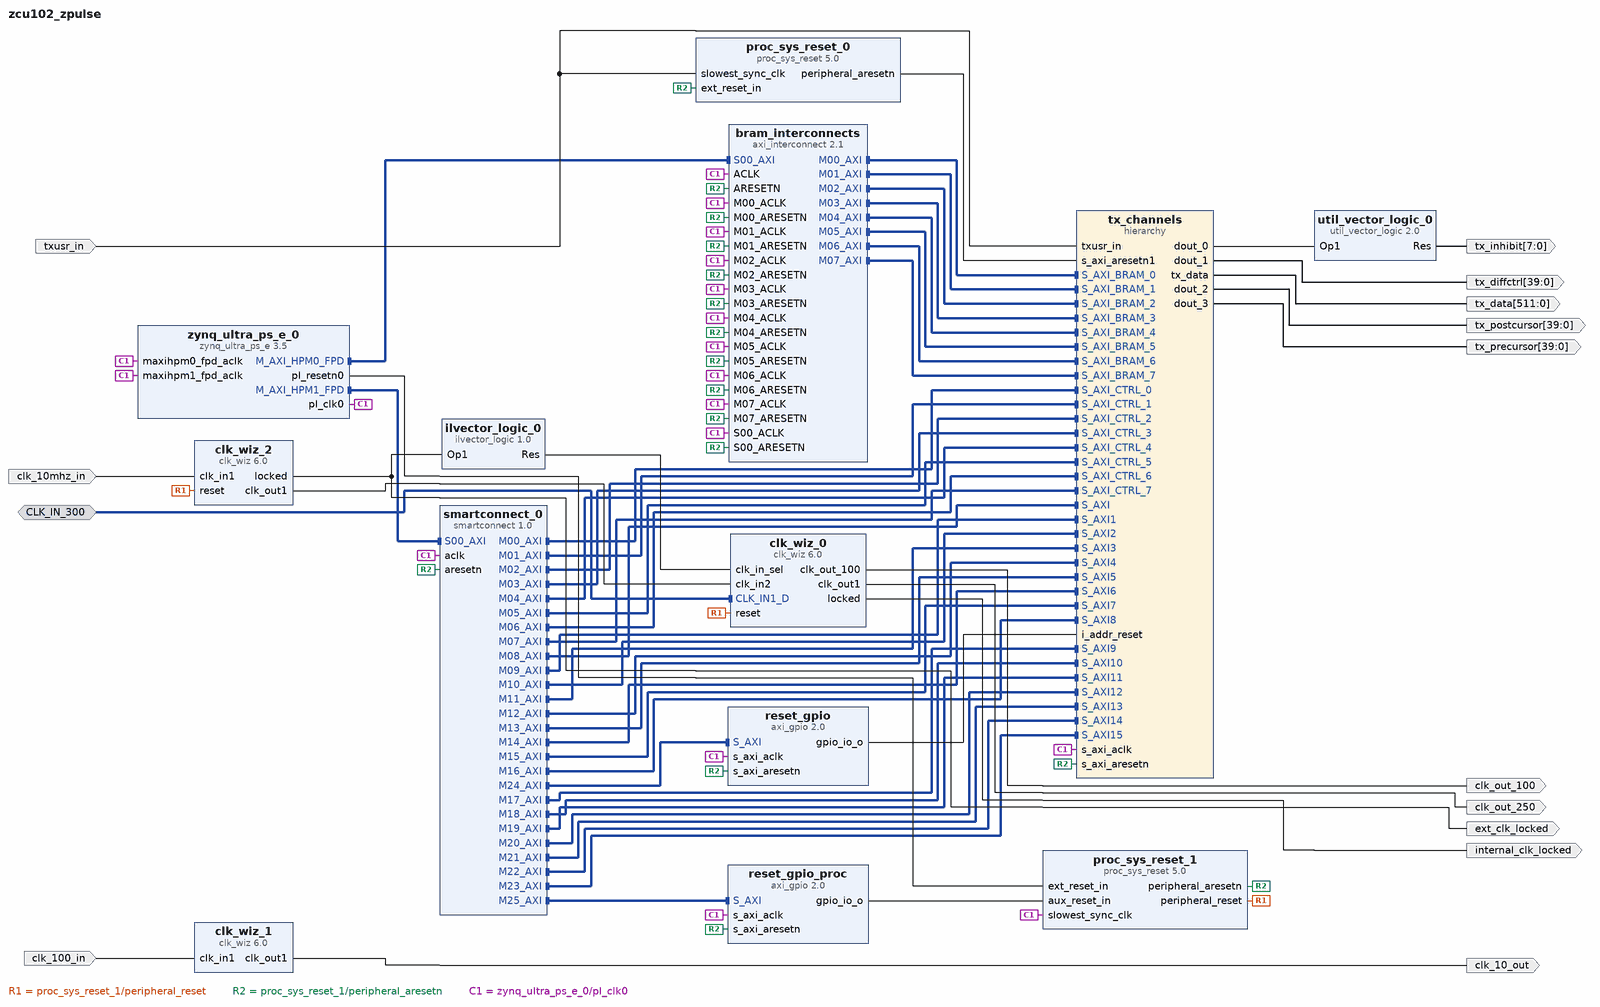
[diagram p0: block diagram of the top level]
# Vivado block design zcu102_zpulse, xczu9eg-ffvb1156-2-e, Vivado 2025.2
create_bd_design zcu102_zpulse

create_bd_intf_port -mode Slave -vlnv xilinx.com:interface:diff_clock_rtl:1.0 CLK_IN_300
create_bd_port -dir O -type clk clk_out_250
create_bd_port -dir I -type clk txusr_in
set_property -dict {CONFIG.FREQ_HZ 250000000} [get_bd_ports txusr_in]
create_bd_port -dir O -type clk clk_10_out
create_bd_port -dir O internal_clk_locked
create_bd_port -dir I -type clk clk_10mhz_in
set_property -dict {CONFIG.FREQ_HZ 10000000} [get_bd_ports clk_10mhz_in]
create_bd_port -dir O ext_clk_locked
create_bd_port -dir O -type clk clk_out_100
create_bd_port -dir O -from 7 -to 0 tx_inhibit
create_bd_port -dir O -from 511 -to 0 tx_data
create_bd_port -dir O -from 39 -to 0 tx_postcursor
create_bd_port -dir O -from 39 -to 0 tx_diffctrl
create_bd_port -dir O -from 39 -to 0 tx_precursor
create_bd_port -dir I -type clk clk_100_in

create_bd_cell -type ip -vlnv xilinx.com:ip:zynq_ultra_ps_e:3.5 zynq_ultra_ps_e_0
set_property -dict [list \
  CONFIG.CAN0_BOARD_INTERFACE custom \
  CONFIG.CAN1_BOARD_INTERFACE custom \
  CONFIG.CSU_BOARD_INTERFACE custom \
  CONFIG.DP_BOARD_INTERFACE custom \
  CONFIG.GEM0_BOARD_INTERFACE custom \
  CONFIG.GEM1_BOARD_INTERFACE custom \
  CONFIG.GEM2_BOARD_INTERFACE custom \
  CONFIG.GEM3_BOARD_INTERFACE custom \
  CONFIG.GPIO_BOARD_INTERFACE custom \
  CONFIG.IIC0_BOARD_INTERFACE custom \
  CONFIG.IIC1_BOARD_INTERFACE custom \
  CONFIG.NAND_BOARD_INTERFACE custom \
  CONFIG.PCIE_BOARD_INTERFACE custom \
  CONFIG.PJTAG_BOARD_INTERFACE custom \
  CONFIG.PMU_BOARD_INTERFACE custom \
  CONFIG.PSU_BANK_0_IO_STANDARD LVCMOS18 \
  CONFIG.PSU_BANK_1_IO_STANDARD LVCMOS18 \
  CONFIG.PSU_BANK_2_IO_STANDARD LVCMOS18 \
  CONFIG.PSU_BANK_3_IO_STANDARD LVCMOS18 \
  CONFIG.PSU_DYNAMIC_DDR_CONFIG_EN 1 \
  CONFIG.PSU_USB3__DUAL_CLOCK_ENABLE 1 \
  CONFIG.PSU__CAN1__PERIPHERAL__ENABLE 1 \
  CONFIG.PSU__CAN1__PERIPHERAL__IO {MIO 24 .. 25} \
  CONFIG.PSU__CRF_APB__ACPU_CTRL__FREQMHZ 1200 \
  CONFIG.PSU__CRF_APB__ACPU_CTRL__SRCSEL APLL \
  CONFIG.PSU__CRF_APB__APLL_CTRL__SRCSEL PSS_REF_CLK \
  CONFIG.PSU__CRF_APB__DBG_FPD_CTRL__FREQMHZ 250 \
  CONFIG.PSU__CRF_APB__DBG_FPD_CTRL__SRCSEL IOPLL \
  CONFIG.PSU__CRF_APB__DBG_TRACE_CTRL__FREQMHZ 125 \
  CONFIG.PSU__CRF_APB__DBG_TRACE_CTRL__SRCSEL IOPLL \
  CONFIG.PSU__CRF_APB__DBG_TSTMP_CTRL__FREQMHZ 250 \
  CONFIG.PSU__CRF_APB__DBG_TSTMP_CTRL__SRCSEL IOPLL \
  CONFIG.PSU__CRF_APB__DDR_CTRL__FREQMHZ 1067 \
  CONFIG.PSU__CRF_APB__DDR_CTRL__SRCSEL DPLL \
  CONFIG.PSU__CRF_APB__DPDMA_REF_CTRL__FREQMHZ 600 \
  CONFIG.PSU__CRF_APB__DPDMA_REF_CTRL__SRCSEL APLL \
  CONFIG.PSU__CRF_APB__DPLL_CTRL__SRCSEL PSS_REF_CLK \
  CONFIG.PSU__CRF_APB__DP_AUDIO_REF_CTRL__SRCSEL RPLL \
  CONFIG.PSU__CRF_APB__DP_STC_REF_CTRL__SRCSEL RPLL \
  CONFIG.PSU__CRF_APB__DP_VIDEO_REF_CTRL__SRCSEL VPLL \
  CONFIG.PSU__CRF_APB__GDMA_REF_CTRL__FREQMHZ 600 \
  CONFIG.PSU__CRF_APB__GDMA_REF_CTRL__SRCSEL APLL \
  CONFIG.PSU__CRF_APB__GPU_REF_CTRL__FREQMHZ 500 \
  CONFIG.PSU__CRF_APB__GPU_REF_CTRL__SRCSEL IOPLL \
  CONFIG.PSU__CRF_APB__TOPSW_LSBUS_CTRL__FREQMHZ 100 \
  CONFIG.PSU__CRF_APB__TOPSW_LSBUS_CTRL__SRCSEL IOPLL \
  CONFIG.PSU__CRF_APB__TOPSW_MAIN_CTRL__FREQMHZ 533.33 \
  CONFIG.PSU__CRF_APB__TOPSW_MAIN_CTRL__SRCSEL DPLL \
  CONFIG.PSU__CRF_APB__VPLL_CTRL__SRCSEL PSS_REF_CLK \
  CONFIG.PSU__CRL_APB__ADMA_REF_CTRL__FREQMHZ 500 \
  CONFIG.PSU__CRL_APB__ADMA_REF_CTRL__SRCSEL IOPLL \
  CONFIG.PSU__CRL_APB__CAN1_REF_CTRL__FREQMHZ 100 \
  CONFIG.PSU__CRL_APB__CAN1_REF_CTRL__SRCSEL IOPLL \
  CONFIG.PSU__CRL_APB__CPU_R5_CTRL__FREQMHZ 500 \
  CONFIG.PSU__CRL_APB__CPU_R5_CTRL__SRCSEL IOPLL \
  CONFIG.PSU__CRL_APB__DBG_LPD_CTRL__FREQMHZ 250 \
  CONFIG.PSU__CRL_APB__DBG_LPD_CTRL__SRCSEL IOPLL \
  CONFIG.PSU__CRL_APB__GEM3_REF_CTRL__FREQMHZ 125 \
  CONFIG.PSU__CRL_APB__GEM3_REF_CTRL__SRCSEL IOPLL \
  CONFIG.PSU__CRL_APB__I2C0_REF_CTRL__FREQMHZ 100 \
  CONFIG.PSU__CRL_APB__I2C0_REF_CTRL__SRCSEL IOPLL \
  CONFIG.PSU__CRL_APB__I2C1_REF_CTRL__FREQMHZ 100 \
  CONFIG.PSU__CRL_APB__I2C1_REF_CTRL__SRCSEL IOPLL \
  CONFIG.PSU__CRL_APB__IOPLL_CTRL__SRCSEL PSS_REF_CLK \
  CONFIG.PSU__CRL_APB__IOU_SWITCH_CTRL__FREQMHZ 250 \
  CONFIG.PSU__CRL_APB__IOU_SWITCH_CTRL__SRCSEL IOPLL \
  CONFIG.PSU__CRL_APB__LPD_LSBUS_CTRL__FREQMHZ 100 \
  CONFIG.PSU__CRL_APB__LPD_LSBUS_CTRL__SRCSEL IOPLL \
  CONFIG.PSU__CRL_APB__LPD_SWITCH_CTRL__FREQMHZ 500 \
  CONFIG.PSU__CRL_APB__LPD_SWITCH_CTRL__SRCSEL IOPLL \
  CONFIG.PSU__CRL_APB__PCAP_CTRL__FREQMHZ 200 \
  CONFIG.PSU__CRL_APB__PCAP_CTRL__SRCSEL IOPLL \
  CONFIG.PSU__CRL_APB__PL0_REF_CTRL__FREQMHZ 100 \
  CONFIG.PSU__CRL_APB__PL0_REF_CTRL__SRCSEL IOPLL \
  CONFIG.PSU__CRL_APB__QSPI_REF_CTRL__FREQMHZ 125 \
  CONFIG.PSU__CRL_APB__QSPI_REF_CTRL__SRCSEL IOPLL \
  CONFIG.PSU__CRL_APB__RPLL_CTRL__SRCSEL PSS_REF_CLK \
  CONFIG.PSU__CRL_APB__SDIO1_REF_CTRL__FREQMHZ 200 \
  CONFIG.PSU__CRL_APB__SDIO1_REF_CTRL__SRCSEL IOPLL \
  CONFIG.PSU__CRL_APB__TIMESTAMP_REF_CTRL__FREQMHZ 100 \
  CONFIG.PSU__CRL_APB__TIMESTAMP_REF_CTRL__SRCSEL IOPLL \
  CONFIG.PSU__CRL_APB__UART0_REF_CTRL__FREQMHZ 100 \
  CONFIG.PSU__CRL_APB__UART0_REF_CTRL__SRCSEL IOPLL \
  CONFIG.PSU__CRL_APB__UART1_REF_CTRL__FREQMHZ 100 \
  CONFIG.PSU__CRL_APB__UART1_REF_CTRL__SRCSEL IOPLL \
  CONFIG.PSU__CRL_APB__USB0_BUS_REF_CTRL__FREQMHZ 250 \
  CONFIG.PSU__CRL_APB__USB0_BUS_REF_CTRL__SRCSEL IOPLL \
  CONFIG.PSU__CRL_APB__USB3_DUAL_REF_CTRL__FREQMHZ 20 \
  CONFIG.PSU__CRL_APB__USB3_DUAL_REF_CTRL__SRCSEL IOPLL \
  CONFIG.PSU__CRL_APB__USB3__ENABLE 1 \
  CONFIG.PSU__CSUPMU__PERIPHERAL__VALID 1 \
  CONFIG.PSU__DDRC__BUS_WIDTH {64 Bit} \
  CONFIG.PSU__DDRC__COMPONENTS UDIMM \
  CONFIG.PSU__DDRC__DEVICE_CAPACITY {4096 MBits} \
  CONFIG.PSU__DDRC__DRAM_WIDTH {8 Bits} \
  CONFIG.PSU__DDRC__ECC Disabled \
  CONFIG.PSU__DDRC__MEMORY_TYPE {DDR 4} \
  CONFIG.PSU__DDRC__SPEED_BIN DDR4_2133P \
  CONFIG.PSU__DDR_HIGH_ADDRESS_GUI_ENABLE 1 \
  CONFIG.PSU__DDR__INTERFACE__FREQMHZ 533.500 \
  CONFIG.PSU__DEVICE_TYPE EG \
  CONFIG.PSU__DISPLAYPORT__LANE0__ENABLE 1 \
  CONFIG.PSU__DISPLAYPORT__LANE0__IO {GT Lane1} \
  CONFIG.PSU__DISPLAYPORT__LANE1__ENABLE 0 \
  CONFIG.PSU__DISPLAYPORT__PERIPHERAL__ENABLE 1 \
  CONFIG.PSU__DLL__ISUSED 1 \
  CONFIG.PSU__DPAUX__PERIPHERAL__ENABLE 1 \
  CONFIG.PSU__DPAUX__PERIPHERAL__IO {MIO 27 .. 30} \
  CONFIG.PSU__DP__LANE_SEL {Single Lower} \
  CONFIG.PSU__DP__REF_CLK_FREQ 27 \
  CONFIG.PSU__DP__REF_CLK_SEL {Ref Clk3} \
  CONFIG.PSU__ENET3__FIFO__ENABLE 0 \
  CONFIG.PSU__ENET3__GRP_MDIO__ENABLE 1 \
  CONFIG.PSU__ENET3__GRP_MDIO__IO {MIO 76 .. 77} \
  CONFIG.PSU__ENET3__PERIPHERAL__ENABLE 1 \
  CONFIG.PSU__ENET3__PERIPHERAL__IO {MIO 64 .. 75} \
  CONFIG.PSU__ENET3__PTP__ENABLE 0 \
  CONFIG.PSU__ENET3__TSU__ENABLE 0 \
  CONFIG.PSU__FPGA_PL0_ENABLE 1 \
  CONFIG.PSU__GEM3_COHERENCY 0 \
  CONFIG.PSU__GEM3_ROUTE_THROUGH_FPD 0 \
  CONFIG.PSU__GEM__TSU__ENABLE 0 \
  CONFIG.PSU__GPIO0_MIO__IO {MIO 0 .. 25} \
  CONFIG.PSU__GPIO0_MIO__PERIPHERAL__ENABLE 1 \
  CONFIG.PSU__GPIO1_MIO__IO {MIO 26 .. 51} \
  CONFIG.PSU__GPIO1_MIO__PERIPHERAL__ENABLE 1 \
  CONFIG.PSU__GT__LINK_SPEED HBR \
  CONFIG.PSU__GT__PRE_EMPH_LVL_4 0 \
  CONFIG.PSU__GT__VLT_SWNG_LVL_4 0 \
  CONFIG.PSU__I2C0__PERIPHERAL__ENABLE 1 \
  CONFIG.PSU__I2C0__PERIPHERAL__IO {MIO 14 .. 15} \
  CONFIG.PSU__I2C1__PERIPHERAL__ENABLE 1 \
  CONFIG.PSU__I2C1__PERIPHERAL__IO {MIO 16 .. 17} \
  CONFIG.PSU__IOU_SLCR__IOU_TTC_APB_CLK__TTC0_SEL APB \
  CONFIG.PSU__IOU_SLCR__IOU_TTC_APB_CLK__TTC1_SEL APB \
  CONFIG.PSU__IOU_SLCR__IOU_TTC_APB_CLK__TTC2_SEL APB \
  CONFIG.PSU__IOU_SLCR__IOU_TTC_APB_CLK__TTC3_SEL APB \
  CONFIG.PSU__IRQ_P2F_USB2_OTG__INT0 0 \
  CONFIG.PSU__IRQ_P2F_USB2_OTG__INT1 0 \
  CONFIG.PSU__MAXIGP0__DATA_WIDTH 128 \
  CONFIG.PSU__OVERRIDE_HPX_QOS 0 \
  CONFIG.PSU__OVERRIDE__BASIC_CLOCK 0 \
  CONFIG.PSU__PCIE__BAR0_VAL 0x0 \
  CONFIG.PSU__PCIE__BAR1_VAL 0x0 \
  CONFIG.PSU__PCIE__BAR2_VAL 0x0 \
  CONFIG.PSU__PCIE__BAR3_VAL 0x0 \
  CONFIG.PSU__PCIE__BAR4_VAL 0x0 \
  CONFIG.PSU__PCIE__BAR5_VAL 0x0 \
  CONFIG.PSU__PCIE__CLASS_CODE_BASE 0x06 \
  CONFIG.PSU__PCIE__CLASS_CODE_INTERFACE 0x0 \
  CONFIG.PSU__PCIE__CLASS_CODE_SUB 0x4 \
  CONFIG.PSU__PCIE__CLASS_CODE_VALUE 0x60400 \
  CONFIG.PSU__PCIE__CRS_SW_VISIBILITY 1 \
  CONFIG.PSU__PCIE__DEVICE_ID 0xD021 \
  CONFIG.PSU__PCIE__DEVICE_PORT_TYPE {Root Port} \
  CONFIG.PSU__PCIE__EROM_VAL 0x0 \
  CONFIG.PSU__PCIE__LANE0__ENABLE 1 \
  CONFIG.PSU__PCIE__LANE0__IO {GT Lane0} \
  CONFIG.PSU__PCIE__LINK_SPEED {5.0 Gb/s} \
  CONFIG.PSU__PCIE__MAXIMUM_LINK_WIDTH x1 \
  CONFIG.PSU__PCIE__MAX_PAYLOAD_SIZE {256 bytes} \
  CONFIG.PSU__PCIE__PERIPHERAL__ENABLE 1 \
  CONFIG.PSU__PCIE__PERIPHERAL__ENDPOINT_ENABLE 0 \
  CONFIG.PSU__PCIE__PERIPHERAL__ROOTPORT_ENABLE 1 \
  CONFIG.PSU__PCIE__PERIPHERAL__ROOTPORT_IO {MIO 31} \
  CONFIG.PSU__PCIE__REF_CLK_FREQ 100 \
  CONFIG.PSU__PCIE__REF_CLK_SEL {Ref Clk0} \
  CONFIG.PSU__PCIE__REVISION_ID 0x0 \
  CONFIG.PSU__PCIE__SUBSYSTEM_ID 0x7 \
  CONFIG.PSU__PCIE__SUBSYSTEM_VENDOR_ID 0x10EE \
  CONFIG.PSU__PCIE__VENDOR_ID 0x10EE \
  CONFIG.PSU__PMU_COHERENCY 0 \
  CONFIG.PSU__PMU__AIBACK__ENABLE 0 \
  CONFIG.PSU__PMU__EMIO_GPI__ENABLE 0 \
  CONFIG.PSU__PMU__EMIO_GPO__ENABLE 0 \
  CONFIG.PSU__PMU__GPI0__ENABLE 0 \
  CONFIG.PSU__PMU__GPI1__ENABLE 0 \
  CONFIG.PSU__PMU__GPI2__ENABLE 0 \
  CONFIG.PSU__PMU__GPI3__ENABLE 0 \
  CONFIG.PSU__PMU__GPI4__ENABLE 0 \
  CONFIG.PSU__PMU__GPI5__ENABLE 0 \
  CONFIG.PSU__PMU__GPO0__ENABLE 1 \
  CONFIG.PSU__PMU__GPO0__IO {MIO 32} \
  CONFIG.PSU__PMU__GPO1__ENABLE 1 \
  CONFIG.PSU__PMU__GPO1__IO {MIO 33} \
  CONFIG.PSU__PMU__GPO2__ENABLE 1 \
  CONFIG.PSU__PMU__GPO2__IO {MIO 34} \
  CONFIG.PSU__PMU__GPO2__POLARITY high \
  CONFIG.PSU__PMU__GPO3__ENABLE 1 \
  CONFIG.PSU__PMU__GPO3__IO {MIO 35} \
  CONFIG.PSU__PMU__GPO3__POLARITY low \
  CONFIG.PSU__PMU__GPO4__ENABLE 1 \
  CONFIG.PSU__PMU__GPO4__IO {MIO 36} \
  CONFIG.PSU__PMU__GPO4__POLARITY low \
  CONFIG.PSU__PMU__GPO5__ENABLE 1 \
  CONFIG.PSU__PMU__GPO5__IO {MIO 37} \
  CONFIG.PSU__PMU__GPO5__POLARITY low \
  CONFIG.PSU__PMU__PERIPHERAL__ENABLE 1 \
  CONFIG.PSU__PMU__PLERROR__ENABLE 0 \
  CONFIG.PSU__PRESET_APPLIED 1 \
  CONFIG.PSU__PSS_REF_CLK__FREQMHZ 33.330 \
  CONFIG.PSU__QSPI_COHERENCY 0 \
  CONFIG.PSU__QSPI_ROUTE_THROUGH_FPD 0 \
  CONFIG.PSU__QSPI__GRP_FBCLK__ENABLE 1 \
  CONFIG.PSU__QSPI__GRP_FBCLK__IO {MIO 6} \
  CONFIG.PSU__QSPI__PERIPHERAL__DATA_MODE x4 \
  CONFIG.PSU__QSPI__PERIPHERAL__ENABLE 1 \
  CONFIG.PSU__QSPI__PERIPHERAL__IO {MIO 0 .. 12} \
  CONFIG.PSU__QSPI__PERIPHERAL__MODE {Dual Parallel} \
  CONFIG.PSU__SATA__LANE1__IO {GT Lane3} \
  CONFIG.PSU__SATA__PERIPHERAL__ENABLE 1 \
  CONFIG.PSU__SATA__REF_CLK_FREQ 125 \
  CONFIG.PSU__SATA__REF_CLK_SEL {Ref Clk1} \
  CONFIG.PSU__SD0__CLK_100_SDR_OTAP_DLY 0x3 \
  CONFIG.PSU__SD0__CLK_200_SDR_OTAP_DLY 0x3 \
  CONFIG.PSU__SD0__CLK_50_DDR_ITAP_DLY 0x3D \
  CONFIG.PSU__SD0__CLK_50_DDR_OTAP_DLY 0x4 \
  CONFIG.PSU__SD0__CLK_50_SDR_ITAP_DLY 0x15 \
  CONFIG.PSU__SD0__CLK_50_SDR_OTAP_DLY 0x5 \
  CONFIG.PSU__SD1_COHERENCY 0 \
  CONFIG.PSU__SD1_ROUTE_THROUGH_FPD 0 \
  CONFIG.PSU__SD1__CLK_100_SDR_OTAP_DLY 0x3 \
  CONFIG.PSU__SD1__CLK_200_SDR_OTAP_DLY 0x3 \
  CONFIG.PSU__SD1__CLK_50_DDR_ITAP_DLY 0x3D \
  CONFIG.PSU__SD1__CLK_50_DDR_OTAP_DLY 0x4 \
  CONFIG.PSU__SD1__CLK_50_SDR_ITAP_DLY 0x15 \
  CONFIG.PSU__SD1__CLK_50_SDR_OTAP_DLY 0x5 \
  CONFIG.PSU__SD1__DATA_TRANSFER_MODE 8Bit \
  CONFIG.PSU__SD1__GRP_CD__ENABLE 1 \
  CONFIG.PSU__SD1__GRP_CD__IO {MIO 45} \
  CONFIG.PSU__SD1__GRP_POW__ENABLE 0 \
  CONFIG.PSU__SD1__GRP_WP__ENABLE 1 \
  CONFIG.PSU__SD1__GRP_WP__IO {MIO 44} \
  CONFIG.PSU__SD1__PERIPHERAL__ENABLE 1 \
  CONFIG.PSU__SD1__PERIPHERAL__IO {MIO 39 .. 51} \
  CONFIG.PSU__SD1__SLOT_TYPE {SD 3.0} \
  CONFIG.PSU__SWDT0__CLOCK__ENABLE 0 \
  CONFIG.PSU__SWDT0__PERIPHERAL__ENABLE 1 \
  CONFIG.PSU__SWDT0__RESET__ENABLE 0 \
  CONFIG.PSU__SWDT1__CLOCK__ENABLE 0 \
  CONFIG.PSU__SWDT1__PERIPHERAL__ENABLE 1 \
  CONFIG.PSU__SWDT1__RESET__ENABLE 0 \
  CONFIG.PSU__TSU__BUFG_PORT_PAIR 0 \
  CONFIG.PSU__TTC0__CLOCK__ENABLE 0 \
  CONFIG.PSU__TTC0__PERIPHERAL__ENABLE 1 \
  CONFIG.PSU__TTC0__WAVEOUT__ENABLE 0 \
  CONFIG.PSU__TTC1__CLOCK__ENABLE 0 \
  CONFIG.PSU__TTC1__PERIPHERAL__ENABLE 1 \
  CONFIG.PSU__TTC1__WAVEOUT__ENABLE 0 \
  CONFIG.PSU__TTC2__CLOCK__ENABLE 0 \
  CONFIG.PSU__TTC2__PERIPHERAL__ENABLE 1 \
  CONFIG.PSU__TTC2__WAVEOUT__ENABLE 0 \
  CONFIG.PSU__TTC3__CLOCK__ENABLE 0 \
  CONFIG.PSU__TTC3__PERIPHERAL__ENABLE 1 \
  CONFIG.PSU__TTC3__WAVEOUT__ENABLE 0 \
  CONFIG.PSU__UART0__BAUD_RATE 115200 \
  CONFIG.PSU__UART0__MODEM__ENABLE 0 \
  CONFIG.PSU__UART0__PERIPHERAL__ENABLE 1 \
  CONFIG.PSU__UART0__PERIPHERAL__IO {MIO 18 .. 19} \
  CONFIG.PSU__UART1__BAUD_RATE 115200 \
  CONFIG.PSU__UART1__MODEM__ENABLE 0 \
  CONFIG.PSU__UART1__PERIPHERAL__ENABLE 1 \
  CONFIG.PSU__UART1__PERIPHERAL__IO {MIO 20 .. 21} \
  CONFIG.PSU__USB0_COHERENCY 0 \
  CONFIG.PSU__USB0__PERIPHERAL__ENABLE 1 \
  CONFIG.PSU__USB0__PERIPHERAL__IO {MIO 52 .. 63} \
  CONFIG.PSU__USB0__REF_CLK_FREQ 26 \
  CONFIG.PSU__USB0__REF_CLK_SEL {Ref Clk2} \
  CONFIG.PSU__USB2_0__EMIO__ENABLE 0 \
  CONFIG.PSU__USB3_0__EMIO__ENABLE 0 \
  CONFIG.PSU__USB3_0__PERIPHERAL__ENABLE 1 \
  CONFIG.PSU__USB3_0__PERIPHERAL__IO {GT Lane2} \
  CONFIG.PSU__USB__RESET__MODE {Boot Pin} \
  CONFIG.PSU__USB__RESET__POLARITY {Active Low} \
  CONFIG.PSU__USE__IRQ0 1 \
  CONFIG.PSU__USE__M_AXI_GP0 1 \
  CONFIG.PSU__USE__M_AXI_GP1 1 \
  CONFIG.PSU__USE__M_AXI_GP2 0 \
  CONFIG.QSPI_BOARD_INTERFACE custom \
  CONFIG.SATA_BOARD_INTERFACE custom \
  CONFIG.SD0_BOARD_INTERFACE custom \
  CONFIG.SD1_BOARD_INTERFACE custom \
  CONFIG.SPI0_BOARD_INTERFACE custom \
  CONFIG.SPI1_BOARD_INTERFACE custom \
  CONFIG.SUBPRESET1 Custom \
  CONFIG.SUBPRESET2 Custom \
  CONFIG.SWDT0_BOARD_INTERFACE custom \
  CONFIG.SWDT1_BOARD_INTERFACE custom \
  CONFIG.TRACE_BOARD_INTERFACE custom \
  CONFIG.TTC0_BOARD_INTERFACE custom \
  CONFIG.TTC1_BOARD_INTERFACE custom \
  CONFIG.TTC2_BOARD_INTERFACE custom \
  CONFIG.TTC3_BOARD_INTERFACE custom \
  CONFIG.UART0_BOARD_INTERFACE custom \
  CONFIG.UART1_BOARD_INTERFACE custom \
  CONFIG.USB0_BOARD_INTERFACE custom \
  CONFIG.USB1_BOARD_INTERFACE custom \
  CONFIG.preset None \
] [get_bd_cells zynq_ultra_ps_e_0]
# 727 more settings of zynq_ultra_ps_e_0 are not shown: defaults, MIO pin electricals, DDR timing, and values the tool derives
create_bd_cell -type ip -vlnv xilinx.com:ip:clk_wiz:6.0 clk_wiz_0
set_property -dict [list \
  CONFIG.CLKIN1_JITTER_PS 33.330000000000005 \
  CONFIG.CLKIN2_JITTER_PS 33.330000000000005 \
  CONFIG.CLKOUT1_JITTER 109.006 \
  CONFIG.CLKOUT1_PHASE_ERROR 98.575 \
  CONFIG.CLKOUT1_REQUESTED_OUT_FREQ 250 \
  CONFIG.CLKOUT2_DRIVES Buffer \
  CONFIG.CLKOUT2_JITTER 129.666 \
  CONFIG.CLKOUT2_PHASE_ERROR 98.575 \
  CONFIG.CLKOUT2_USED true \
  CONFIG.CLK_IN1_BOARD_INTERFACE user_si570_sysclk \
  CONFIG.CLK_OUT2_PORT clk_out_100 \
  CONFIG.MMCM_CLKFBOUT_MULT_F 10.000 \
  CONFIG.MMCM_CLKIN1_PERIOD 3.333 \
  CONFIG.MMCM_CLKIN2_PERIOD 3.333 \
  CONFIG.MMCM_CLKOUT0_DIVIDE_F 4.000 \
  CONFIG.MMCM_CLKOUT1_DIVIDE 10 \
  CONFIG.MMCM_DIVCLK_DIVIDE 3 \
  CONFIG.NUM_OUT_CLKS 2 \
  CONFIG.OPTIMIZE_CLOCKING_STRUCTURE_EN true \
  CONFIG.PRIM_SOURCE Differential_clock_capable_pin \
  CONFIG.SECONDARY_IN_FREQ 300.000 \
  CONFIG.SECONDARY_SOURCE Single_ended_clock_capable_pin \
  CONFIG.USE_INCLK_SWITCHOVER true \
  CONFIG.USE_LOCKED true \
  CONFIG.USE_RESET true \
] [get_bd_cells clk_wiz_0]
create_bd_cell -type ip -vlnv xilinx.com:ip:proc_sys_reset:5.0 proc_sys_reset_0
create_bd_cell -type ip -vlnv xilinx.com:ip:proc_sys_reset:5.0 proc_sys_reset_1
set_property -dict {CONFIG.C_AUX_RESET_HIGH 1} [get_bd_cells proc_sys_reset_1]
create_bd_cell -type ip -vlnv xilinx.com:ip:clk_wiz:6.0 clk_wiz_1
set_property -dict [list \
  CONFIG.CLKIN1_JITTER_PS 100.0 \
  CONFIG.CLKOUT1_JITTER 460.700 \
  CONFIG.CLKOUT1_PHASE_ERROR 523.418 \
  CONFIG.CLKOUT1_REQUESTED_OUT_FREQ 10 \
  CONFIG.MMCM_CLKFBOUT_MULT_F 92.375 \
  CONFIG.MMCM_CLKIN1_PERIOD 10.000 \
  CONFIG.MMCM_CLKIN2_PERIOD 10.000 \
  CONFIG.MMCM_CLKOUT0_DIVIDE_F 92.375 \
  CONFIG.MMCM_DIVCLK_DIVIDE 10 \
  CONFIG.OPTIMIZE_CLOCKING_STRUCTURE_EN true \
  CONFIG.PRIM_IN_FREQ 100 \
  CONFIG.USE_LOCKED false \
  CONFIG.USE_RESET false \
] [get_bd_cells clk_wiz_1]
create_bd_cell -type ip -vlnv xilinx.com:ip:smartconnect:1.0 smartconnect_0
set_property -dict {CONFIG.NUM_MI 26 CONFIG.NUM_SI 1} [get_bd_cells smartconnect_0]
create_bd_cell -type ip -vlnv xilinx.com:ip:axi_gpio:2.0 reset_gpio_proc
set_property -dict {CONFIG.C_ALL_OUTPUTS 1 CONFIG.C_GPIO_WIDTH 1} [get_bd_cells reset_gpio_proc]
create_bd_cell -type ip -vlnv xilinx.com:ip:clk_wiz:6.0 clk_wiz_2
set_property -dict [list \
  CONFIG.CLKIN1_JITTER_PS 100.0 \
  CONFIG.CLKIN1_UI_JITTER 0.001 \
  CONFIG.CLKOUT1_DRIVES Buffer \
  CONFIG.CLKOUT1_JITTER 175.558 \
  CONFIG.CLKOUT1_PHASE_ERROR 601.651 \
  CONFIG.CLKOUT1_REQUESTED_OUT_FREQ 300.000 \
  CONFIG.FEEDBACK_SOURCE FDBK_ONCHIP \
  CONFIG.JITTER_SEL Max_I_Jitter \
  CONFIG.MMCM_BANDWIDTH LOW \
  CONFIG.MMCM_CLKFBOUT_MULT_F 120.000 \
  CONFIG.MMCM_CLKIN1_PERIOD 100.000 \
  CONFIG.MMCM_CLKIN2_PERIOD 10.0 \
  CONFIG.MMCM_CLKOUT0_DIVIDE_F 4.000 \
  CONFIG.MMCM_REF_JITTER1 0.001 \
  CONFIG.OPTIMIZE_CLOCKING_STRUCTURE_EN true \
  CONFIG.PRIM_IN_FREQ 10.00 \
] [get_bd_cells clk_wiz_2]
create_bd_cell -type inline_hdl -vlnv xilinx.com:inline_hdl:ilvector_logic:1.0 ilvector_logic_0
set_property -dict {CONFIG.C_OPERATION not CONFIG.C_SIZE 1} [get_bd_cells ilvector_logic_0]
create_bd_cell -type ip -vlnv xilinx.com:ip:util_vector_logic:2.0 util_vector_logic_0
set_property -dict {CONFIG.C_OPERATION not} [get_bd_cells util_vector_logic_0]
create_bd_cell -type ip -vlnv xilinx.com:ip:axi_gpio:2.0 reset_gpio
set_property -dict {CONFIG.C_ALL_OUTPUTS 1 CONFIG.C_GPIO_WIDTH 1} [get_bd_cells reset_gpio]
create_bd_cell -type ip -vlnv xilinx.com:ip:axi_interconnect:2.1 bram_interconnects
set_property -dict {CONFIG.NUM_MI 8} [get_bd_cells bram_interconnects]
create_bd_cell -type hier tx_channels

# ---- hierarchy /tx_channels ----
current_bd_instance /tx_channels
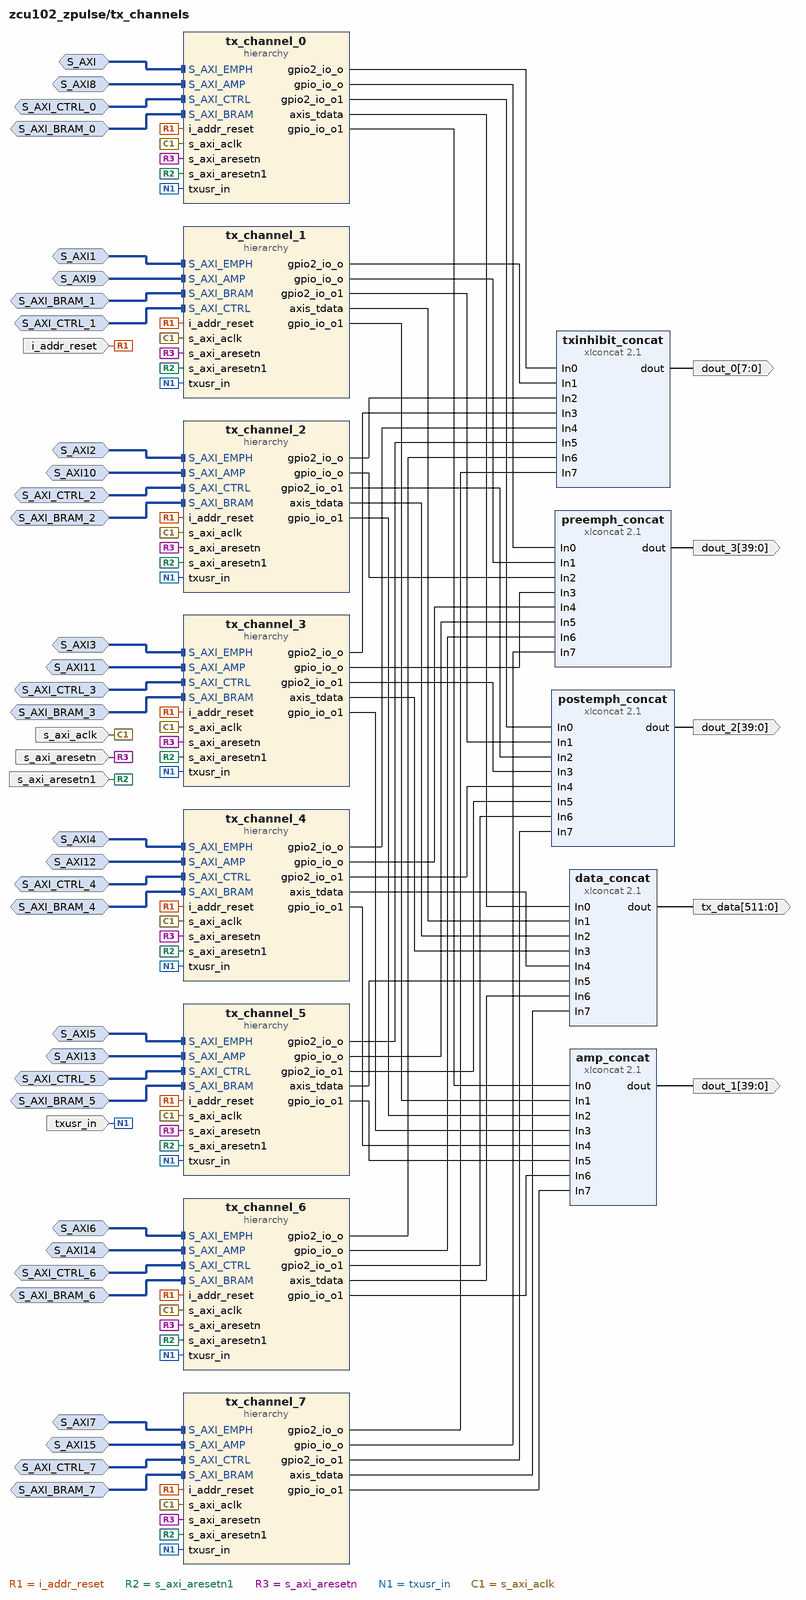
[diagram p1: block diagram inside /tx_channels]
create_bd_intf_pin -mode Slave -vlnv xilinx.com:interface:aximm_rtl:1.0 S_AXI_CTRL_1
create_bd_intf_pin -mode Slave -vlnv xilinx.com:interface:aximm_rtl:1.0 S_AXI_BRAM_1
create_bd_intf_pin -mode Slave -vlnv xilinx.com:interface:aximm_rtl:1.0 S_AXI_CTRL_2
create_bd_intf_pin -mode Slave -vlnv xilinx.com:interface:aximm_rtl:1.0 S_AXI_BRAM_2
create_bd_intf_pin -mode Slave -vlnv xilinx.com:interface:aximm_rtl:1.0 S_AXI_CTRL_3
create_bd_intf_pin -mode Slave -vlnv xilinx.com:interface:aximm_rtl:1.0 S_AXI_BRAM_3
create_bd_intf_pin -mode Slave -vlnv xilinx.com:interface:aximm_rtl:1.0 S_AXI_CTRL_4
create_bd_intf_pin -mode Slave -vlnv xilinx.com:interface:aximm_rtl:1.0 S_AXI_BRAM_4
create_bd_intf_pin -mode Slave -vlnv xilinx.com:interface:aximm_rtl:1.0 S_AXI_CTRL_5
create_bd_intf_pin -mode Slave -vlnv xilinx.com:interface:aximm_rtl:1.0 S_AXI_BRAM_5
create_bd_intf_pin -mode Slave -vlnv xilinx.com:interface:aximm_rtl:1.0 S_AXI_CTRL_6
create_bd_intf_pin -mode Slave -vlnv xilinx.com:interface:aximm_rtl:1.0 S_AXI_BRAM_6
create_bd_intf_pin -mode Slave -vlnv xilinx.com:interface:aximm_rtl:1.0 S_AXI_CTRL_7
create_bd_intf_pin -mode Slave -vlnv xilinx.com:interface:aximm_rtl:1.0 S_AXI_BRAM_7
create_bd_intf_pin -mode Slave -vlnv xilinx.com:interface:aximm_rtl:1.0 S_AXI_CTRL_0
create_bd_intf_pin -mode Slave -vlnv xilinx.com:interface:aximm_rtl:1.0 S_AXI_BRAM_0
create_bd_intf_pin -mode Slave -vlnv xilinx.com:interface:aximm_rtl:1.0 S_AXI
create_bd_intf_pin -mode Slave -vlnv xilinx.com:interface:aximm_rtl:1.0 S_AXI1
create_bd_intf_pin -mode Slave -vlnv xilinx.com:interface:aximm_rtl:1.0 S_AXI2
create_bd_intf_pin -mode Slave -vlnv xilinx.com:interface:aximm_rtl:1.0 S_AXI3
create_bd_intf_pin -mode Slave -vlnv xilinx.com:interface:aximm_rtl:1.0 S_AXI4
create_bd_intf_pin -mode Slave -vlnv xilinx.com:interface:aximm_rtl:1.0 S_AXI5
create_bd_intf_pin -mode Slave -vlnv xilinx.com:interface:aximm_rtl:1.0 S_AXI6
create_bd_intf_pin -mode Slave -vlnv xilinx.com:interface:aximm_rtl:1.0 S_AXI7
create_bd_intf_pin -mode Slave -vlnv xilinx.com:interface:aximm_rtl:1.0 S_AXI8
create_bd_intf_pin -mode Slave -vlnv xilinx.com:interface:aximm_rtl:1.0 S_AXI9
create_bd_intf_pin -mode Slave -vlnv xilinx.com:interface:aximm_rtl:1.0 S_AXI10
create_bd_intf_pin -mode Slave -vlnv xilinx.com:interface:aximm_rtl:1.0 S_AXI11
create_bd_intf_pin -mode Slave -vlnv xilinx.com:interface:aximm_rtl:1.0 S_AXI12
create_bd_intf_pin -mode Slave -vlnv xilinx.com:interface:aximm_rtl:1.0 S_AXI13
create_bd_intf_pin -mode Slave -vlnv xilinx.com:interface:aximm_rtl:1.0 S_AXI14
create_bd_intf_pin -mode Slave -vlnv xilinx.com:interface:aximm_rtl:1.0 S_AXI15
create_bd_pin -dir O -from 511 -to 0 tx_data
create_bd_pin -dir I -type clk s_axi_aclk
create_bd_pin -dir I -type rst s_axi_aresetn
create_bd_pin -dir I -type clk txusr_in
create_bd_pin -dir I -type rst s_axi_aresetn1
create_bd_pin -dir O -from 7 -to 0 dout_0
create_bd_pin -dir O -from 39 -to 0 dout_1
create_bd_pin -dir O -from 39 -to 0 dout_2
create_bd_pin -dir O -from 39 -to 0 dout_3
create_bd_pin -dir I -type rst i_addr_reset

create_bd_cell -type ip -vlnv xilinx.com:ip:xlconcat:2.1 data_concat
set_property -dict {CONFIG.NUM_PORTS 8 CONFIG.dout_width 512} [get_bd_cells data_concat]
create_bd_cell -type hier tx_channel_1
create_bd_cell -type hier tx_channel_0
create_bd_cell -type hier tx_channel_2
create_bd_cell -type hier tx_channel_3
create_bd_cell -type hier tx_channel_4
create_bd_cell -type hier tx_channel_5
create_bd_cell -type hier tx_channel_6
create_bd_cell -type hier tx_channel_7
create_bd_cell -type ip -vlnv xilinx.com:ip:xlconcat:2.1 txinhibit_concat
set_property -dict {CONFIG.NUM_PORTS 8 CONFIG.dout_width 8} [get_bd_cells txinhibit_concat]
create_bd_cell -type ip -vlnv xilinx.com:ip:xlconcat:2.1 preemph_concat
set_property -dict {CONFIG.NUM_PORTS 8 CONFIG.dout_width 40} [get_bd_cells preemph_concat]
create_bd_cell -type ip -vlnv xilinx.com:ip:xlconcat:2.1 amp_concat
set_property -dict {CONFIG.NUM_PORTS 8 CONFIG.dout_width 40} [get_bd_cells amp_concat]
create_bd_cell -type ip -vlnv xilinx.com:ip:xlconcat:2.1 postemph_concat
set_property -dict {CONFIG.NUM_PORTS 8 CONFIG.dout_width 40} [get_bd_cells postemph_concat]

# ---- hierarchy /tx_channels/tx_channel_1 ----
current_bd_instance /tx_channels/tx_channel_1
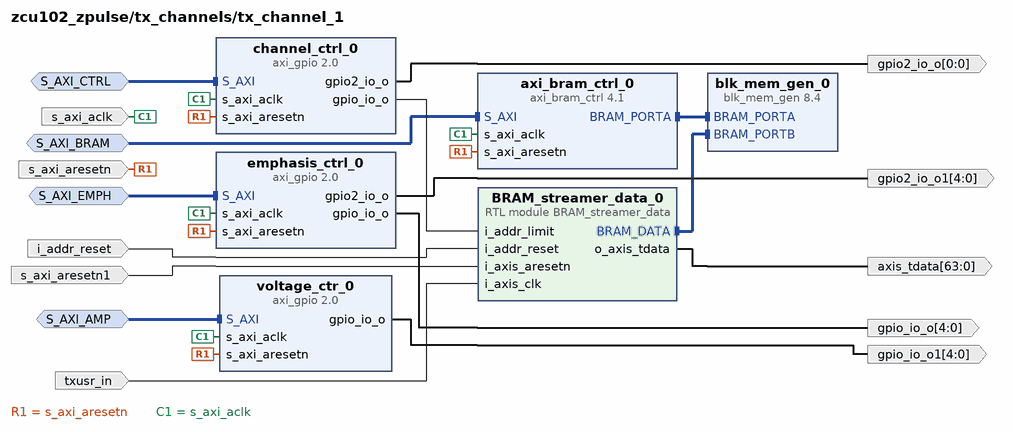
[diagram p2: block diagram inside /tx_channels/tx_channel_1]
create_bd_intf_pin -mode Slave -vlnv xilinx.com:interface:aximm_rtl:1.0 S_AXI_CTRL
create_bd_intf_pin -mode Slave -vlnv xilinx.com:interface:aximm_rtl:1.0 S_AXI_BRAM
create_bd_intf_pin -mode Slave -vlnv xilinx.com:interface:aximm_rtl:1.0 S_AXI_EMPH
create_bd_intf_pin -mode Slave -vlnv xilinx.com:interface:aximm_rtl:1.0 S_AXI_AMP
create_bd_pin -dir I -type clk s_axi_aclk
create_bd_pin -dir I -type rst s_axi_aresetn
create_bd_pin -dir I -type clk txusr_in
create_bd_pin -dir I -type rst s_axi_aresetn1
create_bd_pin -dir O -from 63 -to 0 axis_tdata
create_bd_pin -dir O -from 0 -to 0 gpio2_io_o
create_bd_pin -dir O -from 4 -to 0 gpio_io_o
create_bd_pin -dir O -from 4 -to 0 gpio2_io_o1
create_bd_pin -dir O -from 4 -to 0 gpio_io_o1
create_bd_pin -dir I -type rst i_addr_reset

create_bd_cell -type ip -vlnv xilinx.com:ip:axi_gpio:2.0 channel_ctrl_0
set_property -dict [list \
  CONFIG.C_ALL_OUTPUTS 1 \
  CONFIG.C_ALL_OUTPUTS_2 1 \
  CONFIG.C_DOUT_DEFAULT 0x0000FFFF \
  CONFIG.C_GPIO2_WIDTH 1 \
  CONFIG.C_IS_DUAL 1 \
] [get_bd_cells channel_ctrl_0]
create_bd_cell -type ip -vlnv xilinx.com:ip:blk_mem_gen:8.4 blk_mem_gen_0
set_property -dict [list \
  CONFIG.Assume_Synchronous_Clk false \
  CONFIG.EN_SAFETY_CKT false \
  CONFIG.Enable_B Use_ENB_Pin \
  CONFIG.Memory_Type True_Dual_Port_RAM \
  CONFIG.Operating_Mode_A WRITE_FIRST \
  CONFIG.Operating_Mode_B WRITE_FIRST \
  CONFIG.Port_B_Clock 100 \
  CONFIG.Port_B_Enable_Rate 100 \
  CONFIG.Port_B_Write_Rate 50 \
  CONFIG.Use_RSTB_Pin true \
] [get_bd_cells blk_mem_gen_0]
create_bd_cell -type ip -vlnv xilinx.com:ip:axi_bram_ctrl:4.1 axi_bram_ctrl_0
set_property -dict {CONFIG.DATA_WIDTH 64 CONFIG.SINGLE_PORT_BRAM 1} [get_bd_cells axi_bram_ctrl_0]
create_bd_cell -type module -reference BRAM_streamer_data BRAM_streamer_data_0
create_bd_cell -type ip -vlnv xilinx.com:ip:axi_gpio:2.0 emphasis_ctrl_0
set_property -dict [list \
  CONFIG.C_ALL_OUTPUTS 1 \
  CONFIG.C_ALL_OUTPUTS_2 1 \
  CONFIG.C_GPIO2_WIDTH 5 \
  CONFIG.C_GPIO_WIDTH 5 \
  CONFIG.C_IS_DUAL 1 \
] [get_bd_cells emphasis_ctrl_0]
create_bd_cell -type ip -vlnv xilinx.com:ip:axi_gpio:2.0 voltage_ctr_0
set_property -dict [list \
  CONFIG.C_ALL_OUTPUTS 1 \
  CONFIG.C_DOUT_DEFAULT 0x000000FF \
  CONFIG.C_GPIO_WIDTH 5 \
  CONFIG.C_IS_DUAL 0 \
] [get_bd_cells voltage_ctr_0]

# ---- hierarchy /tx_channels/tx_channel_0 ----
current_bd_instance /tx_channels/tx_channel_0
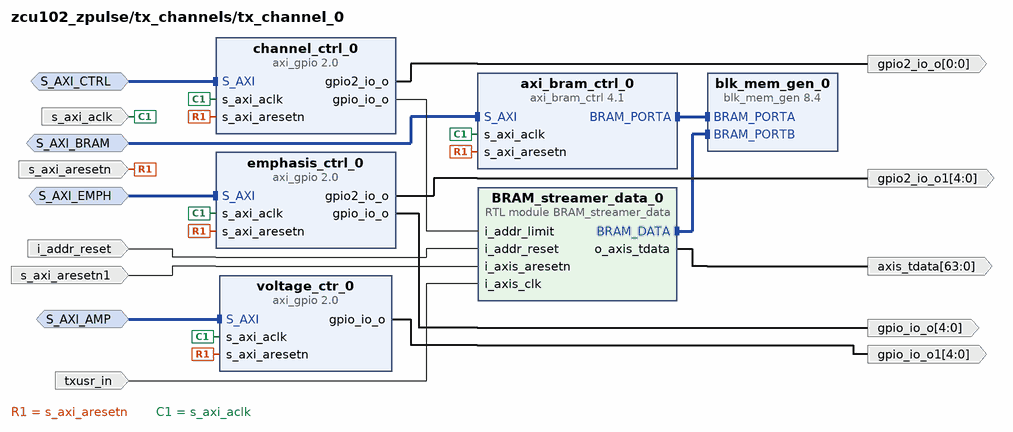
[diagram p3: block diagram inside /tx_channels/tx_channel_0]
create_bd_intf_pin -mode Slave -vlnv xilinx.com:interface:aximm_rtl:1.0 S_AXI_CTRL
create_bd_intf_pin -mode Slave -vlnv xilinx.com:interface:aximm_rtl:1.0 S_AXI_BRAM
create_bd_intf_pin -mode Slave -vlnv xilinx.com:interface:aximm_rtl:1.0 S_AXI_EMPH
create_bd_intf_pin -mode Slave -vlnv xilinx.com:interface:aximm_rtl:1.0 S_AXI_AMP
create_bd_pin -dir I -type clk s_axi_aclk
create_bd_pin -dir I -type rst s_axi_aresetn
create_bd_pin -dir I -type clk txusr_in
create_bd_pin -dir I -type rst s_axi_aresetn1
create_bd_pin -dir O -from 63 -to 0 axis_tdata
create_bd_pin -dir O -from 0 -to 0 gpio2_io_o
create_bd_pin -dir O -from 4 -to 0 gpio_io_o
create_bd_pin -dir O -from 4 -to 0 gpio2_io_o1
create_bd_pin -dir O -from 4 -to 0 gpio_io_o1
create_bd_pin -dir I -type rst i_addr_reset

create_bd_cell -type ip -vlnv xilinx.com:ip:axi_gpio:2.0 channel_ctrl_0
set_property -dict [list \
  CONFIG.C_ALL_OUTPUTS 1 \
  CONFIG.C_ALL_OUTPUTS_2 1 \
  CONFIG.C_DOUT_DEFAULT 0x0000FFFF \
  CONFIG.C_GPIO2_WIDTH 1 \
  CONFIG.C_IS_DUAL 1 \
] [get_bd_cells channel_ctrl_0]
create_bd_cell -type ip -vlnv xilinx.com:ip:blk_mem_gen:8.4 blk_mem_gen_0
set_property -dict [list \
  CONFIG.Assume_Synchronous_Clk false \
  CONFIG.EN_SAFETY_CKT false \
  CONFIG.Enable_B Use_ENB_Pin \
  CONFIG.Memory_Type True_Dual_Port_RAM \
  CONFIG.Operating_Mode_A WRITE_FIRST \
  CONFIG.Operating_Mode_B WRITE_FIRST \
  CONFIG.Port_B_Clock 100 \
  CONFIG.Port_B_Enable_Rate 100 \
  CONFIG.Port_B_Write_Rate 50 \
  CONFIG.Use_RSTB_Pin true \
] [get_bd_cells blk_mem_gen_0]
create_bd_cell -type ip -vlnv xilinx.com:ip:axi_bram_ctrl:4.1 axi_bram_ctrl_0
set_property -dict {CONFIG.DATA_WIDTH 64 CONFIG.SINGLE_PORT_BRAM 1} [get_bd_cells axi_bram_ctrl_0]
create_bd_cell -type module -reference BRAM_streamer_data BRAM_streamer_data_0
create_bd_cell -type ip -vlnv xilinx.com:ip:axi_gpio:2.0 emphasis_ctrl_0
set_property -dict [list \
  CONFIG.C_ALL_OUTPUTS 1 \
  CONFIG.C_ALL_OUTPUTS_2 1 \
  CONFIG.C_GPIO2_WIDTH 5 \
  CONFIG.C_GPIO_WIDTH 5 \
  CONFIG.C_IS_DUAL 1 \
] [get_bd_cells emphasis_ctrl_0]
create_bd_cell -type ip -vlnv xilinx.com:ip:axi_gpio:2.0 voltage_ctr_0
set_property -dict [list \
  CONFIG.C_ALL_OUTPUTS 1 \
  CONFIG.C_DOUT_DEFAULT 0x000000FF \
  CONFIG.C_GPIO_WIDTH 5 \
  CONFIG.C_IS_DUAL 0 \
] [get_bd_cells voltage_ctr_0]

# ---- hierarchy /tx_channels/tx_channel_2 ----
current_bd_instance /tx_channels/tx_channel_2
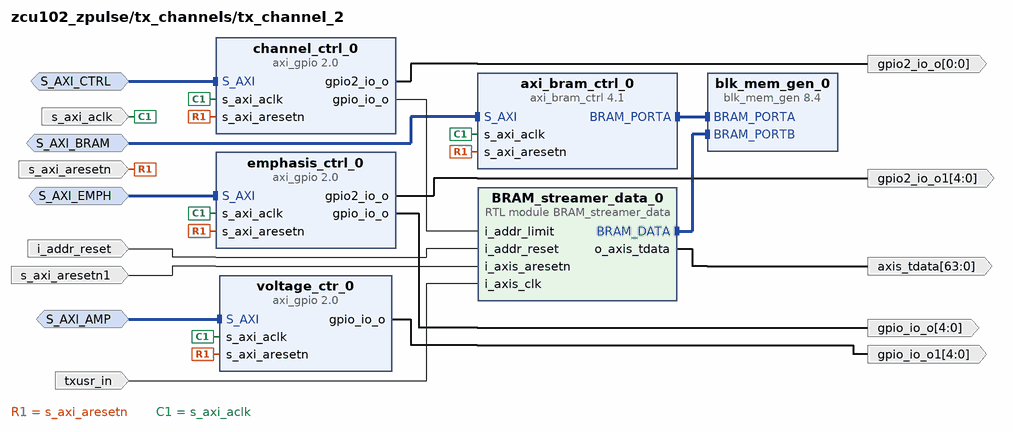
[diagram p4: block diagram inside /tx_channels/tx_channel_2]
create_bd_intf_pin -mode Slave -vlnv xilinx.com:interface:aximm_rtl:1.0 S_AXI_CTRL
create_bd_intf_pin -mode Slave -vlnv xilinx.com:interface:aximm_rtl:1.0 S_AXI_BRAM
create_bd_intf_pin -mode Slave -vlnv xilinx.com:interface:aximm_rtl:1.0 S_AXI_EMPH
create_bd_intf_pin -mode Slave -vlnv xilinx.com:interface:aximm_rtl:1.0 S_AXI_AMP
create_bd_pin -dir I -type clk s_axi_aclk
create_bd_pin -dir I -type rst s_axi_aresetn
create_bd_pin -dir I -type clk txusr_in
create_bd_pin -dir I -type rst s_axi_aresetn1
create_bd_pin -dir O -from 63 -to 0 axis_tdata
create_bd_pin -dir O -from 0 -to 0 gpio2_io_o
create_bd_pin -dir O -from 4 -to 0 gpio_io_o
create_bd_pin -dir O -from 4 -to 0 gpio2_io_o1
create_bd_pin -dir O -from 4 -to 0 gpio_io_o1
create_bd_pin -dir I -type rst i_addr_reset

create_bd_cell -type ip -vlnv xilinx.com:ip:axi_gpio:2.0 channel_ctrl_0
set_property -dict [list \
  CONFIG.C_ALL_OUTPUTS 1 \
  CONFIG.C_ALL_OUTPUTS_2 1 \
  CONFIG.C_DOUT_DEFAULT 0x0000FFFF \
  CONFIG.C_GPIO2_WIDTH 1 \
  CONFIG.C_IS_DUAL 1 \
] [get_bd_cells channel_ctrl_0]
create_bd_cell -type ip -vlnv xilinx.com:ip:blk_mem_gen:8.4 blk_mem_gen_0
set_property -dict [list \
  CONFIG.Assume_Synchronous_Clk false \
  CONFIG.EN_SAFETY_CKT false \
  CONFIG.Enable_B Use_ENB_Pin \
  CONFIG.Memory_Type True_Dual_Port_RAM \
  CONFIG.Operating_Mode_A WRITE_FIRST \
  CONFIG.Operating_Mode_B WRITE_FIRST \
  CONFIG.Port_B_Clock 100 \
  CONFIG.Port_B_Enable_Rate 100 \
  CONFIG.Port_B_Write_Rate 50 \
  CONFIG.Use_RSTB_Pin true \
] [get_bd_cells blk_mem_gen_0]
create_bd_cell -type ip -vlnv xilinx.com:ip:axi_bram_ctrl:4.1 axi_bram_ctrl_0
set_property -dict {CONFIG.DATA_WIDTH 64 CONFIG.SINGLE_PORT_BRAM 1} [get_bd_cells axi_bram_ctrl_0]
create_bd_cell -type module -reference BRAM_streamer_data BRAM_streamer_data_0
create_bd_cell -type ip -vlnv xilinx.com:ip:axi_gpio:2.0 emphasis_ctrl_0
set_property -dict [list \
  CONFIG.C_ALL_OUTPUTS 1 \
  CONFIG.C_ALL_OUTPUTS_2 1 \
  CONFIG.C_GPIO2_WIDTH 5 \
  CONFIG.C_GPIO_WIDTH 5 \
  CONFIG.C_IS_DUAL 1 \
] [get_bd_cells emphasis_ctrl_0]
create_bd_cell -type ip -vlnv xilinx.com:ip:axi_gpio:2.0 voltage_ctr_0
set_property -dict [list \
  CONFIG.C_ALL_OUTPUTS 1 \
  CONFIG.C_DOUT_DEFAULT 0x000000FF \
  CONFIG.C_GPIO_WIDTH 5 \
  CONFIG.C_IS_DUAL 0 \
] [get_bd_cells voltage_ctr_0]

# ---- hierarchy /tx_channels/tx_channel_3 ----
current_bd_instance /tx_channels/tx_channel_3
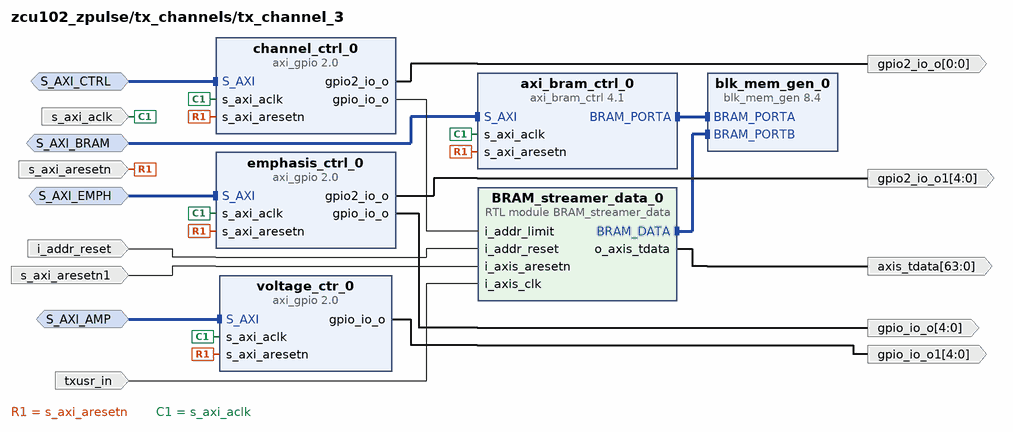
[diagram p5: block diagram inside /tx_channels/tx_channel_3]
create_bd_intf_pin -mode Slave -vlnv xilinx.com:interface:aximm_rtl:1.0 S_AXI_CTRL
create_bd_intf_pin -mode Slave -vlnv xilinx.com:interface:aximm_rtl:1.0 S_AXI_BRAM
create_bd_intf_pin -mode Slave -vlnv xilinx.com:interface:aximm_rtl:1.0 S_AXI_EMPH
create_bd_intf_pin -mode Slave -vlnv xilinx.com:interface:aximm_rtl:1.0 S_AXI_AMP
create_bd_pin -dir I -type clk s_axi_aclk
create_bd_pin -dir I -type rst s_axi_aresetn
create_bd_pin -dir O -from 63 -to 0 axis_tdata
create_bd_pin -dir O -from 0 -to 0 gpio2_io_o
create_bd_pin -dir I -type clk txusr_in
create_bd_pin -dir I -type rst s_axi_aresetn1
create_bd_pin -dir O -from 4 -to 0 gpio_io_o
create_bd_pin -dir O -from 4 -to 0 gpio2_io_o1
create_bd_pin -dir O -from 4 -to 0 gpio_io_o1
create_bd_pin -dir I -type rst i_addr_reset

create_bd_cell -type ip -vlnv xilinx.com:ip:axi_gpio:2.0 channel_ctrl_0
set_property -dict [list \
  CONFIG.C_ALL_OUTPUTS 1 \
  CONFIG.C_ALL_OUTPUTS_2 1 \
  CONFIG.C_DOUT_DEFAULT 0x0000FFFF \
  CONFIG.C_GPIO2_WIDTH 1 \
  CONFIG.C_IS_DUAL 1 \
] [get_bd_cells channel_ctrl_0]
create_bd_cell -type ip -vlnv xilinx.com:ip:blk_mem_gen:8.4 blk_mem_gen_0
set_property -dict [list \
  CONFIG.Assume_Synchronous_Clk false \
  CONFIG.EN_SAFETY_CKT false \
  CONFIG.Enable_B Use_ENB_Pin \
  CONFIG.Memory_Type True_Dual_Port_RAM \
  CONFIG.Operating_Mode_A WRITE_FIRST \
  CONFIG.Operating_Mode_B WRITE_FIRST \
  CONFIG.Port_B_Clock 100 \
  CONFIG.Port_B_Enable_Rate 100 \
  CONFIG.Port_B_Write_Rate 50 \
  CONFIG.Use_RSTB_Pin true \
] [get_bd_cells blk_mem_gen_0]
create_bd_cell -type ip -vlnv xilinx.com:ip:axi_bram_ctrl:4.1 axi_bram_ctrl_0
set_property -dict {CONFIG.DATA_WIDTH 64 CONFIG.SINGLE_PORT_BRAM 1} [get_bd_cells axi_bram_ctrl_0]
create_bd_cell -type module -reference BRAM_streamer_data BRAM_streamer_data_0
create_bd_cell -type ip -vlnv xilinx.com:ip:axi_gpio:2.0 emphasis_ctrl_0
set_property -dict [list \
  CONFIG.C_ALL_OUTPUTS 1 \
  CONFIG.C_ALL_OUTPUTS_2 1 \
  CONFIG.C_GPIO2_WIDTH 5 \
  CONFIG.C_GPIO_WIDTH 5 \
  CONFIG.C_IS_DUAL 1 \
] [get_bd_cells emphasis_ctrl_0]
create_bd_cell -type ip -vlnv xilinx.com:ip:axi_gpio:2.0 voltage_ctr_0
set_property -dict [list \
  CONFIG.C_ALL_OUTPUTS 1 \
  CONFIG.C_DOUT_DEFAULT 0x000000FF \
  CONFIG.C_GPIO_WIDTH 5 \
  CONFIG.C_IS_DUAL 0 \
] [get_bd_cells voltage_ctr_0]

# ---- hierarchy /tx_channels/tx_channel_4 ----
current_bd_instance /tx_channels/tx_channel_4
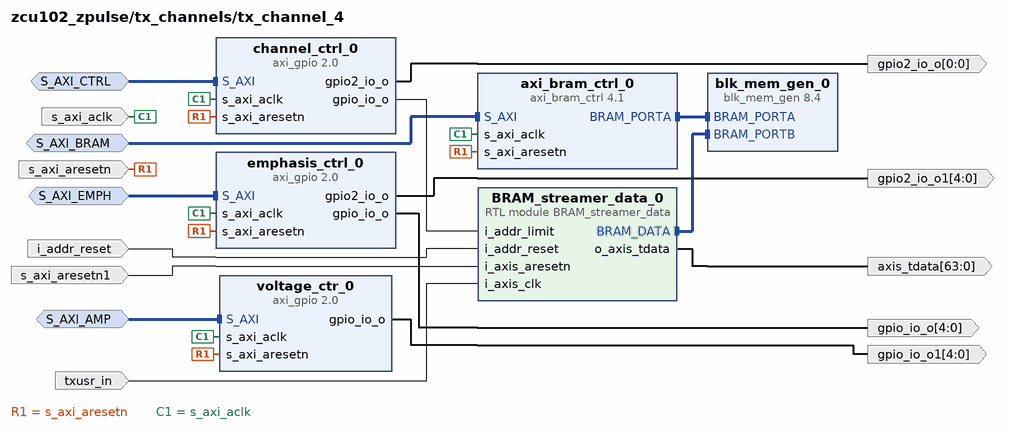
[diagram p6: block diagram inside /tx_channels/tx_channel_4]
create_bd_intf_pin -mode Slave -vlnv xilinx.com:interface:aximm_rtl:1.0 S_AXI_CTRL
create_bd_intf_pin -mode Slave -vlnv xilinx.com:interface:aximm_rtl:1.0 S_AXI_BRAM
create_bd_intf_pin -mode Slave -vlnv xilinx.com:interface:aximm_rtl:1.0 S_AXI_EMPH
create_bd_intf_pin -mode Slave -vlnv xilinx.com:interface:aximm_rtl:1.0 S_AXI_AMP
create_bd_pin -dir I -type clk s_axi_aclk
create_bd_pin -dir I -type rst s_axi_aresetn
create_bd_pin -dir I -type clk txusr_in
create_bd_pin -dir I -type rst s_axi_aresetn1
create_bd_pin -dir O -from 63 -to 0 axis_tdata
create_bd_pin -dir O -from 0 -to 0 gpio2_io_o
create_bd_pin -dir O -from 4 -to 0 gpio_io_o
create_bd_pin -dir O -from 4 -to 0 gpio2_io_o1
create_bd_pin -dir O -from 4 -to 0 gpio_io_o1
create_bd_pin -dir I -type rst i_addr_reset

create_bd_cell -type ip -vlnv xilinx.com:ip:axi_gpio:2.0 channel_ctrl_0
set_property -dict [list \
  CONFIG.C_ALL_OUTPUTS 1 \
  CONFIG.C_ALL_OUTPUTS_2 1 \
  CONFIG.C_DOUT_DEFAULT 0x0000FFFF \
  CONFIG.C_GPIO2_WIDTH 1 \
  CONFIG.C_IS_DUAL 1 \
] [get_bd_cells channel_ctrl_0]
create_bd_cell -type ip -vlnv xilinx.com:ip:blk_mem_gen:8.4 blk_mem_gen_0
set_property -dict [list \
  CONFIG.Assume_Synchronous_Clk false \
  CONFIG.EN_SAFETY_CKT false \
  CONFIG.Enable_B Use_ENB_Pin \
  CONFIG.Memory_Type True_Dual_Port_RAM \
  CONFIG.Operating_Mode_A WRITE_FIRST \
  CONFIG.Operating_Mode_B WRITE_FIRST \
  CONFIG.Port_B_Clock 100 \
  CONFIG.Port_B_Enable_Rate 100 \
  CONFIG.Port_B_Write_Rate 50 \
  CONFIG.Use_RSTB_Pin true \
] [get_bd_cells blk_mem_gen_0]
create_bd_cell -type ip -vlnv xilinx.com:ip:axi_bram_ctrl:4.1 axi_bram_ctrl_0
set_property -dict {CONFIG.DATA_WIDTH 64 CONFIG.SINGLE_PORT_BRAM 1} [get_bd_cells axi_bram_ctrl_0]
create_bd_cell -type module -reference BRAM_streamer_data BRAM_streamer_data_0
create_bd_cell -type ip -vlnv xilinx.com:ip:axi_gpio:2.0 emphasis_ctrl_0
set_property -dict [list \
  CONFIG.C_ALL_OUTPUTS 1 \
  CONFIG.C_ALL_OUTPUTS_2 1 \
  CONFIG.C_GPIO2_WIDTH 5 \
  CONFIG.C_GPIO_WIDTH 5 \
  CONFIG.C_IS_DUAL 1 \
] [get_bd_cells emphasis_ctrl_0]
create_bd_cell -type ip -vlnv xilinx.com:ip:axi_gpio:2.0 voltage_ctr_0
set_property -dict [list \
  CONFIG.C_ALL_OUTPUTS 1 \
  CONFIG.C_DOUT_DEFAULT 0x000000FF \
  CONFIG.C_GPIO_WIDTH 5 \
  CONFIG.C_IS_DUAL 0 \
] [get_bd_cells voltage_ctr_0]

# ---- hierarchy /tx_channels/tx_channel_5 ----
current_bd_instance /tx_channels/tx_channel_5
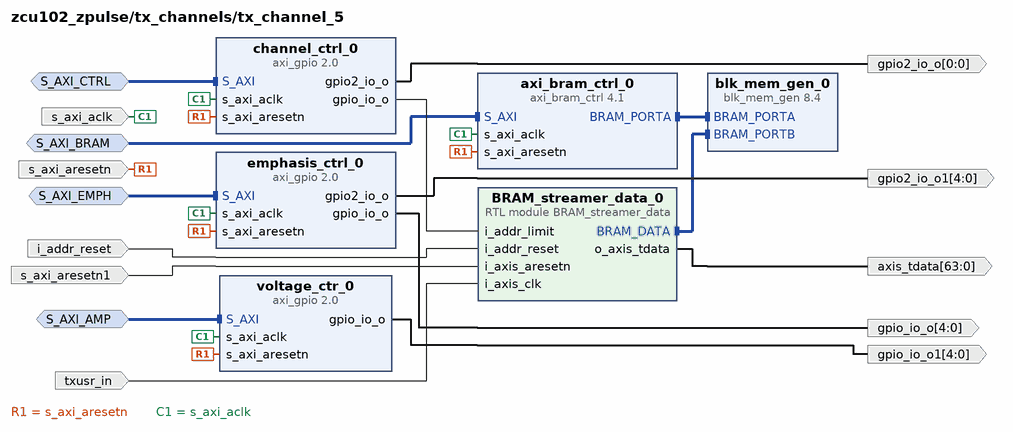
[diagram p7: block diagram inside /tx_channels/tx_channel_5]
create_bd_intf_pin -mode Slave -vlnv xilinx.com:interface:aximm_rtl:1.0 S_AXI_CTRL
create_bd_intf_pin -mode Slave -vlnv xilinx.com:interface:aximm_rtl:1.0 S_AXI_BRAM
create_bd_intf_pin -mode Slave -vlnv xilinx.com:interface:aximm_rtl:1.0 S_AXI_EMPH
create_bd_intf_pin -mode Slave -vlnv xilinx.com:interface:aximm_rtl:1.0 S_AXI_AMP
create_bd_pin -dir I -type clk s_axi_aclk
create_bd_pin -dir I -type rst s_axi_aresetn
create_bd_pin -dir I -type clk txusr_in
create_bd_pin -dir I -type rst s_axi_aresetn1
create_bd_pin -dir O -from 63 -to 0 axis_tdata
create_bd_pin -dir O -from 0 -to 0 gpio2_io_o
create_bd_pin -dir O -from 4 -to 0 gpio_io_o
create_bd_pin -dir O -from 4 -to 0 gpio2_io_o1
create_bd_pin -dir O -from 4 -to 0 gpio_io_o1
create_bd_pin -dir I -type rst i_addr_reset

create_bd_cell -type ip -vlnv xilinx.com:ip:axi_gpio:2.0 channel_ctrl_0
set_property -dict [list \
  CONFIG.C_ALL_OUTPUTS 1 \
  CONFIG.C_ALL_OUTPUTS_2 1 \
  CONFIG.C_DOUT_DEFAULT 0x0000FFFF \
  CONFIG.C_GPIO2_WIDTH 1 \
  CONFIG.C_IS_DUAL 1 \
] [get_bd_cells channel_ctrl_0]
create_bd_cell -type ip -vlnv xilinx.com:ip:blk_mem_gen:8.4 blk_mem_gen_0
set_property -dict [list \
  CONFIG.Assume_Synchronous_Clk false \
  CONFIG.EN_SAFETY_CKT false \
  CONFIG.Enable_B Use_ENB_Pin \
  CONFIG.Memory_Type True_Dual_Port_RAM \
  CONFIG.Operating_Mode_A WRITE_FIRST \
  CONFIG.Operating_Mode_B WRITE_FIRST \
  CONFIG.Port_B_Clock 100 \
  CONFIG.Port_B_Enable_Rate 100 \
  CONFIG.Port_B_Write_Rate 50 \
  CONFIG.Use_RSTB_Pin true \
] [get_bd_cells blk_mem_gen_0]
create_bd_cell -type ip -vlnv xilinx.com:ip:axi_bram_ctrl:4.1 axi_bram_ctrl_0
set_property -dict {CONFIG.DATA_WIDTH 64 CONFIG.SINGLE_PORT_BRAM 1} [get_bd_cells axi_bram_ctrl_0]
create_bd_cell -type module -reference BRAM_streamer_data BRAM_streamer_data_0
create_bd_cell -type ip -vlnv xilinx.com:ip:axi_gpio:2.0 emphasis_ctrl_0
set_property -dict [list \
  CONFIG.C_ALL_OUTPUTS 1 \
  CONFIG.C_ALL_OUTPUTS_2 1 \
  CONFIG.C_GPIO2_WIDTH 5 \
  CONFIG.C_GPIO_WIDTH 5 \
  CONFIG.C_IS_DUAL 1 \
] [get_bd_cells emphasis_ctrl_0]
create_bd_cell -type ip -vlnv xilinx.com:ip:axi_gpio:2.0 voltage_ctr_0
set_property -dict [list \
  CONFIG.C_ALL_OUTPUTS 1 \
  CONFIG.C_DOUT_DEFAULT 0x000000FF \
  CONFIG.C_GPIO_WIDTH 5 \
  CONFIG.C_IS_DUAL 0 \
] [get_bd_cells voltage_ctr_0]

# ---- hierarchy /tx_channels/tx_channel_6 ----
current_bd_instance /tx_channels/tx_channel_6
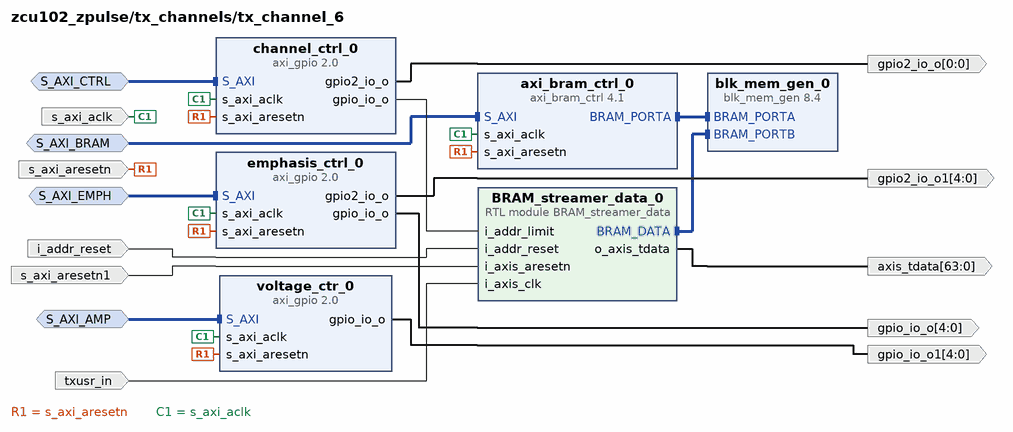
[diagram p8: block diagram inside /tx_channels/tx_channel_6]
create_bd_intf_pin -mode Slave -vlnv xilinx.com:interface:aximm_rtl:1.0 S_AXI_CTRL
create_bd_intf_pin -mode Slave -vlnv xilinx.com:interface:aximm_rtl:1.0 S_AXI_BRAM
create_bd_intf_pin -mode Slave -vlnv xilinx.com:interface:aximm_rtl:1.0 S_AXI_EMPH
create_bd_intf_pin -mode Slave -vlnv xilinx.com:interface:aximm_rtl:1.0 S_AXI_AMP
create_bd_pin -dir I -type clk s_axi_aclk
create_bd_pin -dir I -type rst s_axi_aresetn
create_bd_pin -dir I -type clk txusr_in
create_bd_pin -dir I -type rst s_axi_aresetn1
create_bd_pin -dir O -from 63 -to 0 axis_tdata
create_bd_pin -dir O -from 0 -to 0 gpio2_io_o
create_bd_pin -dir O -from 4 -to 0 gpio_io_o
create_bd_pin -dir O -from 4 -to 0 gpio2_io_o1
create_bd_pin -dir O -from 4 -to 0 gpio_io_o1
create_bd_pin -dir I -type rst i_addr_reset

create_bd_cell -type ip -vlnv xilinx.com:ip:axi_gpio:2.0 channel_ctrl_0
set_property -dict [list \
  CONFIG.C_ALL_OUTPUTS 1 \
  CONFIG.C_ALL_OUTPUTS_2 1 \
  CONFIG.C_DOUT_DEFAULT 0x0000FFFF \
  CONFIG.C_GPIO2_WIDTH 1 \
  CONFIG.C_IS_DUAL 1 \
] [get_bd_cells channel_ctrl_0]
create_bd_cell -type ip -vlnv xilinx.com:ip:blk_mem_gen:8.4 blk_mem_gen_0
set_property -dict [list \
  CONFIG.Assume_Synchronous_Clk false \
  CONFIG.EN_SAFETY_CKT false \
  CONFIG.Enable_B Use_ENB_Pin \
  CONFIG.Memory_Type True_Dual_Port_RAM \
  CONFIG.Operating_Mode_A WRITE_FIRST \
  CONFIG.Operating_Mode_B WRITE_FIRST \
  CONFIG.Port_B_Clock 100 \
  CONFIG.Port_B_Enable_Rate 100 \
  CONFIG.Port_B_Write_Rate 50 \
  CONFIG.Use_RSTB_Pin true \
] [get_bd_cells blk_mem_gen_0]
create_bd_cell -type ip -vlnv xilinx.com:ip:axi_bram_ctrl:4.1 axi_bram_ctrl_0
set_property -dict {CONFIG.DATA_WIDTH 64 CONFIG.SINGLE_PORT_BRAM 1} [get_bd_cells axi_bram_ctrl_0]
create_bd_cell -type module -reference BRAM_streamer_data BRAM_streamer_data_0
create_bd_cell -type ip -vlnv xilinx.com:ip:axi_gpio:2.0 emphasis_ctrl_0
set_property -dict [list \
  CONFIG.C_ALL_OUTPUTS 1 \
  CONFIG.C_ALL_OUTPUTS_2 1 \
  CONFIG.C_GPIO2_WIDTH 5 \
  CONFIG.C_GPIO_WIDTH 5 \
  CONFIG.C_IS_DUAL 1 \
] [get_bd_cells emphasis_ctrl_0]
create_bd_cell -type ip -vlnv xilinx.com:ip:axi_gpio:2.0 voltage_ctr_0
set_property -dict [list \
  CONFIG.C_ALL_OUTPUTS 1 \
  CONFIG.C_DOUT_DEFAULT 0x000000FF \
  CONFIG.C_GPIO_WIDTH 5 \
  CONFIG.C_IS_DUAL 0 \
] [get_bd_cells voltage_ctr_0]

# ---- hierarchy /tx_channels/tx_channel_7 ----
current_bd_instance /tx_channels/tx_channel_7
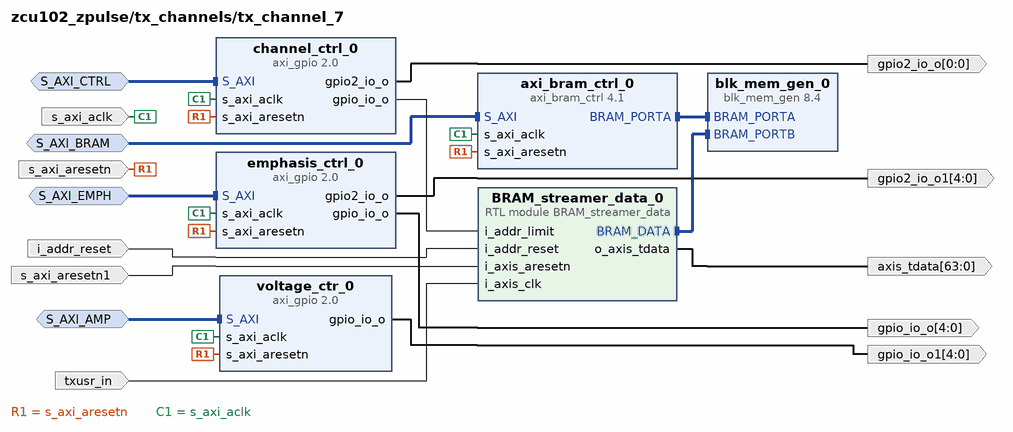
[diagram p9: block diagram inside /tx_channels/tx_channel_7]
create_bd_intf_pin -mode Slave -vlnv xilinx.com:interface:aximm_rtl:1.0 S_AXI_CTRL
create_bd_intf_pin -mode Slave -vlnv xilinx.com:interface:aximm_rtl:1.0 S_AXI_BRAM
create_bd_intf_pin -mode Slave -vlnv xilinx.com:interface:aximm_rtl:1.0 S_AXI_EMPH
create_bd_intf_pin -mode Slave -vlnv xilinx.com:interface:aximm_rtl:1.0 S_AXI_AMP
create_bd_pin -dir I -type clk s_axi_aclk
create_bd_pin -dir I -type rst s_axi_aresetn
create_bd_pin -dir I -type clk txusr_in
create_bd_pin -dir I -type rst s_axi_aresetn1
create_bd_pin -dir O -from 63 -to 0 axis_tdata
create_bd_pin -dir O -from 0 -to 0 gpio2_io_o
create_bd_pin -dir O -from 4 -to 0 gpio2_io_o1
create_bd_pin -dir O -from 4 -to 0 gpio_io_o
create_bd_pin -dir O -from 4 -to 0 gpio_io_o1
create_bd_pin -dir I -type rst i_addr_reset

create_bd_cell -type ip -vlnv xilinx.com:ip:axi_gpio:2.0 channel_ctrl_0
set_property -dict [list \
  CONFIG.C_ALL_OUTPUTS 1 \
  CONFIG.C_ALL_OUTPUTS_2 1 \
  CONFIG.C_DOUT_DEFAULT 0x0000FFFF \
  CONFIG.C_GPIO2_WIDTH 1 \
  CONFIG.C_IS_DUAL 1 \
] [get_bd_cells channel_ctrl_0]
create_bd_cell -type ip -vlnv xilinx.com:ip:axi_bram_ctrl:4.1 axi_bram_ctrl_0
set_property -dict {CONFIG.DATA_WIDTH 64 CONFIG.SINGLE_PORT_BRAM 1} [get_bd_cells axi_bram_ctrl_0]
create_bd_cell -type module -reference BRAM_streamer_data BRAM_streamer_data_0
create_bd_cell -type ip -vlnv xilinx.com:ip:blk_mem_gen:8.4 blk_mem_gen_0
set_property -dict [list \
  CONFIG.Assume_Synchronous_Clk false \
  CONFIG.EN_SAFETY_CKT false \
  CONFIG.Enable_B Use_ENB_Pin \
  CONFIG.Memory_Type True_Dual_Port_RAM \
  CONFIG.Operating_Mode_A WRITE_FIRST \
  CONFIG.Operating_Mode_B WRITE_FIRST \
  CONFIG.Port_B_Clock 100 \
  CONFIG.Port_B_Enable_Rate 100 \
  CONFIG.Port_B_Write_Rate 50 \
  CONFIG.Use_RSTB_Pin true \
] [get_bd_cells blk_mem_gen_0]
create_bd_cell -type ip -vlnv xilinx.com:ip:axi_gpio:2.0 emphasis_ctrl_0
set_property -dict [list \
  CONFIG.C_ALL_OUTPUTS 1 \
  CONFIG.C_ALL_OUTPUTS_2 1 \
  CONFIG.C_GPIO2_WIDTH 5 \
  CONFIG.C_GPIO_WIDTH 5 \
  CONFIG.C_IS_DUAL 1 \
] [get_bd_cells emphasis_ctrl_0]
create_bd_cell -type ip -vlnv xilinx.com:ip:axi_gpio:2.0 voltage_ctr_0
set_property -dict [list \
  CONFIG.C_ALL_OUTPUTS 1 \
  CONFIG.C_DOUT_DEFAULT 0x000000FF \
  CONFIG.C_GPIO_WIDTH 5 \
  CONFIG.C_IS_DUAL 0 \
] [get_bd_cells voltage_ctr_0]

# ---- connections ----

current_bd_instance /tx_channels
connect_bd_intf_net [get_bd_intf_pins tx_channel_0/S_AXI_EMPH] [get_bd_intf_pins S_AXI]
connect_bd_intf_net [get_bd_intf_pins tx_channel_1/S_AXI_EMPH] [get_bd_intf_pins S_AXI1]
connect_bd_intf_net [get_bd_intf_pins tx_channel_2/S_AXI_EMPH] [get_bd_intf_pins S_AXI2]
connect_bd_intf_net [get_bd_intf_pins tx_channel_3/S_AXI_EMPH] [get_bd_intf_pins S_AXI3]
connect_bd_intf_net [get_bd_intf_pins tx_channel_4/S_AXI_EMPH] [get_bd_intf_pins S_AXI4]
connect_bd_intf_net [get_bd_intf_pins tx_channel_5/S_AXI_EMPH] [get_bd_intf_pins S_AXI5]
connect_bd_intf_net [get_bd_intf_pins tx_channel_6/S_AXI_EMPH] [get_bd_intf_pins S_AXI6]
connect_bd_intf_net [get_bd_intf_pins tx_channel_7/S_AXI_EMPH] [get_bd_intf_pins S_AXI7]
connect_bd_intf_net [get_bd_intf_pins tx_channel_0/S_AXI_AMP] [get_bd_intf_pins S_AXI8]
connect_bd_intf_net [get_bd_intf_pins tx_channel_1/S_AXI_AMP] [get_bd_intf_pins S_AXI9]
connect_bd_intf_net [get_bd_intf_pins tx_channel_2/S_AXI_AMP] [get_bd_intf_pins S_AXI10]
connect_bd_intf_net [get_bd_intf_pins tx_channel_3/S_AXI_AMP] [get_bd_intf_pins S_AXI11]
connect_bd_intf_net [get_bd_intf_pins tx_channel_4/S_AXI_AMP] [get_bd_intf_pins S_AXI12]
connect_bd_intf_net [get_bd_intf_pins tx_channel_5/S_AXI_AMP] [get_bd_intf_pins S_AXI13]
connect_bd_intf_net [get_bd_intf_pins tx_channel_6/S_AXI_AMP] [get_bd_intf_pins S_AXI14]
connect_bd_intf_net [get_bd_intf_pins tx_channel_7/S_AXI_AMP] [get_bd_intf_pins S_AXI15]
connect_bd_intf_net [get_bd_intf_pins S_AXI_CTRL_6] [get_bd_intf_pins tx_channel_6/S_AXI_CTRL]
connect_bd_intf_net [get_bd_intf_pins S_AXI_BRAM_6] [get_bd_intf_pins tx_channel_6/S_AXI_BRAM]
connect_bd_intf_net [get_bd_intf_pins S_AXI_CTRL_7] [get_bd_intf_pins tx_channel_7/S_AXI_CTRL]
connect_bd_intf_net [get_bd_intf_pins S_AXI_BRAM_7] [get_bd_intf_pins tx_channel_7/S_AXI_BRAM]
connect_bd_intf_net [get_bd_intf_pins S_AXI_CTRL_0] [get_bd_intf_pins tx_channel_0/S_AXI_CTRL]
connect_bd_intf_net [get_bd_intf_pins S_AXI_BRAM_0] [get_bd_intf_pins tx_channel_0/S_AXI_BRAM]
connect_bd_intf_net [get_bd_intf_pins S_AXI_CTRL_2] [get_bd_intf_pins tx_channel_2/S_AXI_CTRL]
connect_bd_intf_net [get_bd_intf_pins S_AXI_BRAM_2] [get_bd_intf_pins tx_channel_2/S_AXI_BRAM]
connect_bd_intf_net [get_bd_intf_pins S_AXI_CTRL_3] [get_bd_intf_pins tx_channel_3/S_AXI_CTRL]
connect_bd_intf_net [get_bd_intf_pins S_AXI_BRAM_3] [get_bd_intf_pins tx_channel_3/S_AXI_BRAM]
connect_bd_intf_net [get_bd_intf_pins S_AXI_CTRL_4] [get_bd_intf_pins tx_channel_4/S_AXI_CTRL]
connect_bd_intf_net [get_bd_intf_pins S_AXI_BRAM_4] [get_bd_intf_pins tx_channel_4/S_AXI_BRAM]
connect_bd_intf_net [get_bd_intf_pins S_AXI_CTRL_5] [get_bd_intf_pins tx_channel_5/S_AXI_CTRL]
connect_bd_intf_net [get_bd_intf_pins S_AXI_BRAM_5] [get_bd_intf_pins tx_channel_5/S_AXI_BRAM]
connect_bd_intf_net [get_bd_intf_pins S_AXI_BRAM_1] [get_bd_intf_pins tx_channel_1/S_AXI_BRAM]
connect_bd_intf_net [get_bd_intf_pins S_AXI_CTRL_1] [get_bd_intf_pins tx_channel_1/S_AXI_CTRL]
connect_bd_net [get_bd_pins amp_concat/dout] [get_bd_pins dout_1]
connect_bd_net [get_bd_pins i_addr_reset] \
  [get_bd_pins tx_channel_3/i_addr_reset] [get_bd_pins tx_channel_2/i_addr_reset] [get_bd_pins tx_channel_1/i_addr_reset] \
  [get_bd_pins tx_channel_4/i_addr_reset] [get_bd_pins tx_channel_5/i_addr_reset] [get_bd_pins tx_channel_6/i_addr_reset] \
  [get_bd_pins tx_channel_7/i_addr_reset] [get_bd_pins tx_channel_0/i_addr_reset]
connect_bd_net [get_bd_pins postemph_concat/dout] [get_bd_pins dout_2]
connect_bd_net [get_bd_pins preemph_concat/dout] [get_bd_pins dout_3]
connect_bd_net -net proc_sys_reset_0_peripheral_aresetn [get_bd_pins s_axi_aresetn1] \
  [get_bd_pins tx_channel_1/s_axi_aresetn1] [get_bd_pins tx_channel_0/s_axi_aresetn1] \
  [get_bd_pins tx_channel_4/s_axi_aresetn1] [get_bd_pins tx_channel_5/s_axi_aresetn1] \
  [get_bd_pins tx_channel_6/s_axi_aresetn1] [get_bd_pins tx_channel_7/s_axi_aresetn1] \
  [get_bd_pins tx_channel_2/s_axi_aresetn1] [get_bd_pins tx_channel_3/s_axi_aresetn1]
connect_bd_net -net proc_sys_reset_1_peripheral_aresetn [get_bd_pins s_axi_aresetn] \
  [get_bd_pins tx_channel_1/s_axi_aresetn] [get_bd_pins tx_channel_0/s_axi_aresetn] [get_bd_pins tx_channel_4/s_axi_aresetn] \
  [get_bd_pins tx_channel_5/s_axi_aresetn] [get_bd_pins tx_channel_6/s_axi_aresetn] [get_bd_pins tx_channel_7/s_axi_aresetn] \
  [get_bd_pins tx_channel_3/s_axi_aresetn] [get_bd_pins tx_channel_2/s_axi_aresetn]
connect_bd_net -net s_axi_aclk_0_1 [get_bd_pins txusr_in] \
  [get_bd_pins tx_channel_1/txusr_in] [get_bd_pins tx_channel_4/txusr_in] [get_bd_pins tx_channel_0/txusr_in] \
  [get_bd_pins tx_channel_5/txusr_in] [get_bd_pins tx_channel_6/txusr_in] [get_bd_pins tx_channel_7/txusr_in] \
  [get_bd_pins tx_channel_2/txusr_in] [get_bd_pins tx_channel_3/txusr_in]
connect_bd_net [get_bd_pins tx_channel_0/axis_tdata] [get_bd_pins data_concat/In0]
connect_bd_net [get_bd_pins tx_channel_0/gpio2_io_o] [get_bd_pins txinhibit_concat/In0]
connect_bd_net [get_bd_pins tx_channel_0/gpio2_io_o1] [get_bd_pins postemph_concat/In0]
connect_bd_net [get_bd_pins tx_channel_0/gpio_io_o] [get_bd_pins preemph_concat/In0]
connect_bd_net [get_bd_pins tx_channel_0/gpio_io_o1] [get_bd_pins amp_concat/In0]
connect_bd_net [get_bd_pins tx_channel_1/axis_tdata] [get_bd_pins data_concat/In1]
connect_bd_net [get_bd_pins tx_channel_1/gpio2_io_o] [get_bd_pins txinhibit_concat/In1]
connect_bd_net [get_bd_pins tx_channel_1/gpio2_io_o1] [get_bd_pins postemph_concat/In1]
connect_bd_net [get_bd_pins tx_channel_1/gpio_io_o] [get_bd_pins preemph_concat/In1]
connect_bd_net [get_bd_pins tx_channel_1/gpio_io_o1] [get_bd_pins amp_concat/In1]
connect_bd_net [get_bd_pins tx_channel_2/axis_tdata] [get_bd_pins data_concat/In2]
connect_bd_net [get_bd_pins tx_channel_2/gpio2_io_o] [get_bd_pins txinhibit_concat/In2]
connect_bd_net [get_bd_pins tx_channel_2/gpio2_io_o1] [get_bd_pins postemph_concat/In2]
connect_bd_net [get_bd_pins tx_channel_2/gpio_io_o] [get_bd_pins preemph_concat/In2]
connect_bd_net [get_bd_pins tx_channel_2/gpio_io_o1] [get_bd_pins amp_concat/In2]
connect_bd_net [get_bd_pins tx_channel_3/axis_tdata] [get_bd_pins data_concat/In3]
connect_bd_net [get_bd_pins tx_channel_3/gpio2_io_o] [get_bd_pins txinhibit_concat/In3]
connect_bd_net [get_bd_pins tx_channel_3/gpio2_io_o1] [get_bd_pins postemph_concat/In3]
connect_bd_net [get_bd_pins tx_channel_3/gpio_io_o] [get_bd_pins preemph_concat/In3]
connect_bd_net [get_bd_pins tx_channel_3/gpio_io_o1] [get_bd_pins amp_concat/In3]
connect_bd_net [get_bd_pins tx_channel_4/axis_tdata] [get_bd_pins data_concat/In4]
connect_bd_net [get_bd_pins tx_channel_4/gpio2_io_o] [get_bd_pins txinhibit_concat/In4]
connect_bd_net [get_bd_pins tx_channel_4/gpio2_io_o1] [get_bd_pins postemph_concat/In4]
connect_bd_net [get_bd_pins tx_channel_4/gpio_io_o] [get_bd_pins preemph_concat/In4]
connect_bd_net [get_bd_pins tx_channel_4/gpio_io_o1] [get_bd_pins amp_concat/In4]
connect_bd_net [get_bd_pins tx_channel_5/axis_tdata] [get_bd_pins data_concat/In5]
connect_bd_net [get_bd_pins tx_channel_5/gpio2_io_o] [get_bd_pins txinhibit_concat/In5]
connect_bd_net [get_bd_pins tx_channel_5/gpio2_io_o1] [get_bd_pins postemph_concat/In5]
connect_bd_net [get_bd_pins tx_channel_5/gpio_io_o] [get_bd_pins preemph_concat/In5]
connect_bd_net [get_bd_pins tx_channel_5/gpio_io_o1] [get_bd_pins amp_concat/In5]
connect_bd_net [get_bd_pins tx_channel_6/axis_tdata] [get_bd_pins data_concat/In6]
connect_bd_net [get_bd_pins tx_channel_6/gpio2_io_o] [get_bd_pins txinhibit_concat/In6]
connect_bd_net [get_bd_pins tx_channel_6/gpio2_io_o1] [get_bd_pins postemph_concat/In6]
connect_bd_net [get_bd_pins tx_channel_6/gpio_io_o] [get_bd_pins preemph_concat/In6]
connect_bd_net [get_bd_pins tx_channel_6/gpio_io_o1] [get_bd_pins amp_concat/In6]
